# Altium project QCopterCAM.PrjPCB
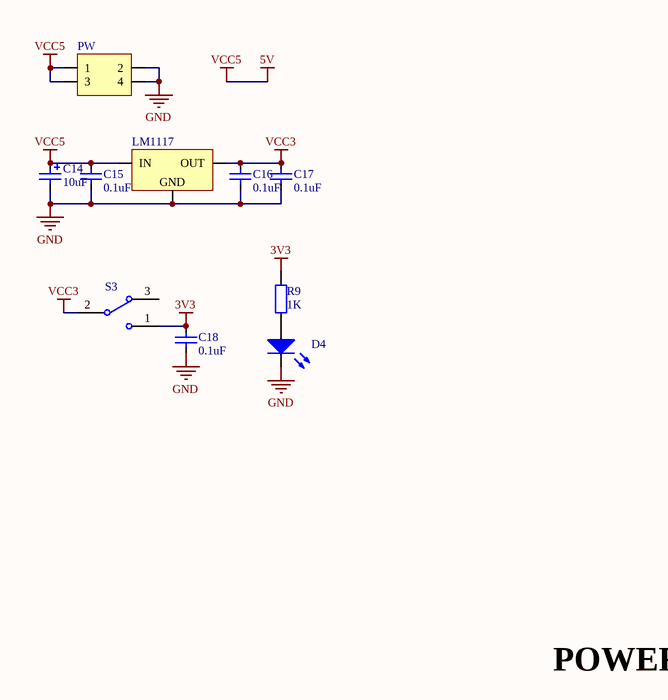
[diagram p0: QCopterCAM_POWER_Sch.SchDoc]
6 sheets, 47 parts. Net scope: flat (ports and power ports of the same name join across sheets).
Board file: QCopterCAM__Pcb.PcbDoc
Sheets:
  QCopterCAM_POWER_Sch.SchDoc
  QCopterCAM_SWD_Sch.SchDoc
  QCopterCAM_MCU_Sch.SchDoc
  QCopterCAM_LED_Sch.SchDoc
  QCopterCAM_PWM_Sch.SchDoc
  QCopterCAM_CAM_Sch.SchDoc

## Sheet QCopterCAM_POWER_Sch.SchDoc
size A4

### Parts
C14  value 10uF  [CAP_TAN_B1210]  (hidden comment: Cap_Tan_1210)
C15  value 0.1uF  [CAP_0603]  (hidden comment: Cap_0603)
C16  value 0.1uF  [CAP_0603]  (hidden comment: Cap_0603)
C17  value 0.1uF  [CAP_0603]  (hidden comment: Cap_0603)
C18  value 0.1uF  [CAP_0603]  (hidden comment: Cap_0603)
D4  LED_0603_BLUE  [LED_0603_BLUE]  (value not drawn)
LM1  LM1117  [SOT223]
PW  HDR2X2_90_2.54  [HDR2X2_90_2.54]  (value not drawn)
R9  value 1K  [RES_0603]  (hidden comment: Res_0603)
S3  SW-SPDT  [SW_T]  (value not drawn)

### Nets
3V3: C18.2 R9.2 S3.1
5V: C14.1 C15.2 LM1.3(IN) PW.1 PW.3  [also labelled VCC5]
GND: C14.2 C15.1 C16.1 C17.1 C18.1 D4.2(K) LM1.1(GND) PW.2 PW.4
VCC3: C16.2 C17.2 LM1.2(OUT) S3.2
NetD4_1: D4.1(A) R9.1

Not connected (* = marked no-connect by the designer): S3 3

### Notes on the sheet
- POWER

### Library data of the parts
C14 = Cap_Tan_1210: Capacitor
C15-C18 = Cap_0603: Capacitor
D4 = LED_0603_BLUE: LED
LM1 = LM1117: Power
PW = HDR2X2_90_2.54: Header
R9 = Res_0603: Resistor
S3 = SW-SPDT_1: SPDT Subminiature Toggle Switch, Right Angle Mounting, Vertical Actuation; Published: 24-Mar-1999; LatestRevisionDate: 17-Dec-2003; LatestRevisionNote: Schematic revised, PCB Footprint replaced.; DatasheetVersion: 05-Dec-2000; PackageReference: TL36WW15050; Publisher: Altium Limited; PackageDescription: Switch; 4 Leads; ComponentLink1Description: Manufacturer Link; ComponentLink1URL: http://www.apem.com

## Sheet QCopterCAM_SWD_Sch.SchDoc
size A4
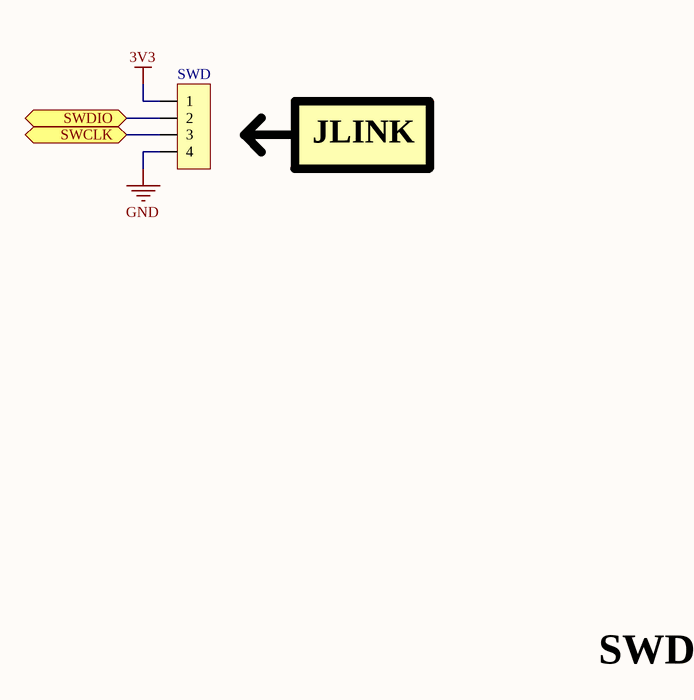
[diagram p1: QCopterCAM_SWD_Sch.SchDoc]

### Parts
SWD  HDR1X4_90F_2.54  [HDR1X4_90F_2.54]  (value not drawn)

### Ports
SWCLK, SWDIO

### Nets
3V3: SWD.1
GND: SWD.4
NetSWD_2: SWD.2 ; port SWDIO
NetSWD_3: SWD.3 ; port SWCLK

### Notes on the sheet
- JLINK
- SWD

### Library data of the parts
SWD = HDR1X4_90F_2.54: Header

## Sheet QCopterCAM_MCU_Sch.SchDoc
size A4
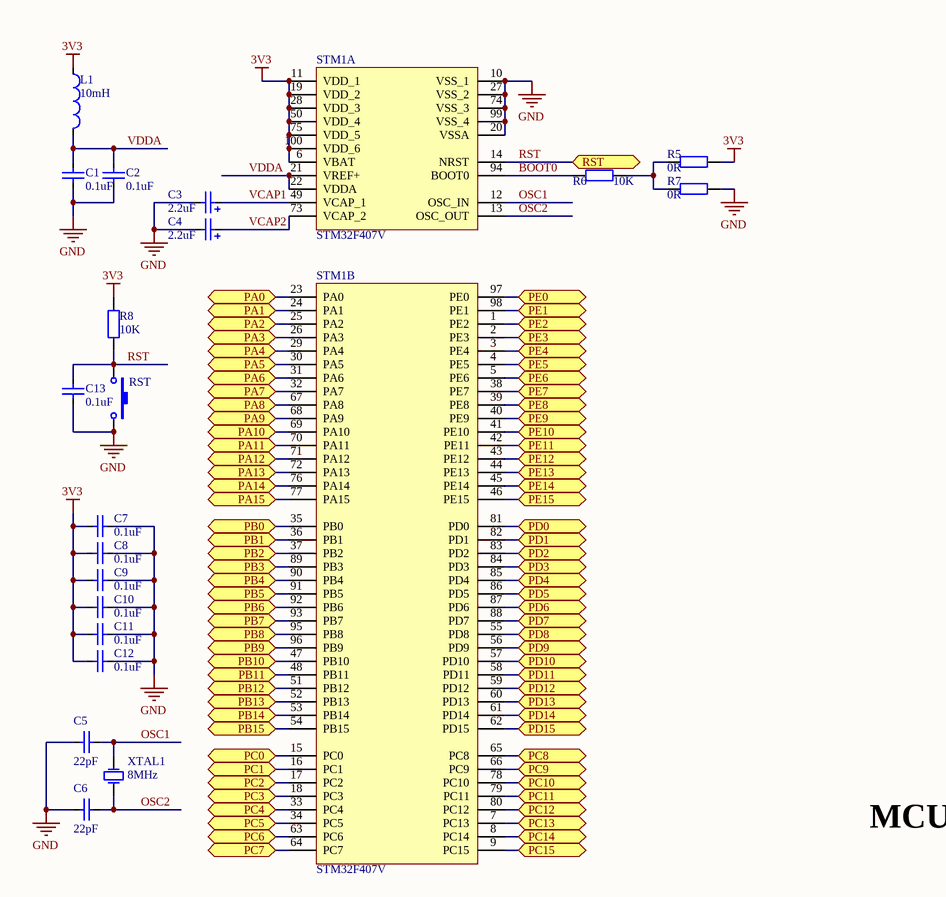
[diagram p2: QCopterCAM_MCU_Sch.SchDoc]

### Parts
C1  value 0.1uF  [CAP_0603]  (hidden comment: Cap_0603)
C2  value 0.1uF  [CAP_0603]  (hidden comment: Cap_0603)
C3  value 2.2uF  [CAP_TAN_P0805]  (hidden comment: Cap_Tan_0805)
C4  value 2.2uF  [CAP_TAN_P0805]  (hidden comment: Cap_Tan_0805)
C5  value 22pF  [CAP_0603]  (hidden comment: Cap_0603)
C6  value 22pF  [CAP_0603]  (hidden comment: Cap_0603)
C7  value 0.1uF  [CAP_0603]  (hidden comment: Cap_0603)
C8  value 0.1uF  [CAP_0603]  (hidden comment: Cap_0603)
C9  value 0.1uF  [CAP_0603]  (hidden comment: Cap_0603)
C10  value 0.1uF  [CAP_0603]  (hidden comment: Cap_0603)
C11  value 0.1uF  [CAP_0603]  (hidden comment: Cap_0603)
C12  value 0.1uF  [CAP_0603]  (hidden comment: Cap_0603)
C13  value 0.1uF  [CAP_0603]  (hidden comment: Cap_0603)
L1  value 10mH  [IND_0603]  (hidden comment: Ind_0603)
R5  value 0R  [RES_0603]  (hidden comment: Res_0603)
R6  value 10K  [RES_0603]  (hidden comment: Res_0603)
R7  value 0R  [RES_0603]  (hidden comment: Res_0603)
R8  value 10K  [RES_0603]  (hidden comment: Res_0603)
RST  SW-PB_1  [BT_90_T]  (value not drawn)
STM1  STM32F407V  [STM32F_100]  (parts A,B of 2)
XTAL1  value 8MHz  [XTAL_5032]  (hidden comment: XTAL_5032)

### Ports
PA0, PA1, PA2, PA3, PA4, PA5, PA6, PA7, PA8, PA9, PA10, PA11, PA12, PA13, PA14, PA15, PB0, PB1, PB2, PB3, PB4, PB5, PB6, PB7, PB8, PB9, PB10, PB11, PB12, PB13, PB14, PB15, PC0, PC1, PC2, PC3, PC4, PC5, PC6, PC7, PC8, PC9, PC10, PC11, PC12, PC13, PC14, PC15, PD0, PD1, PD2, PD3, PD4, PD5, PD6, PD7, PD8, PD9, PD10, PD11, PD12, PD13, PD14, PD15, PE0, PE1, PE2, PE3, PE4, PE5, PE6, PE7, PE8, PE9, PE10, PE11, PE12, PE13, PE14, PE15, RST

### Nets
3V3: C7.2 C8.2 C9.2 C10.2 C11.2 C12.2 L1.1 R5.2 R8.1 STM1.6(VBAT) STM1.11(VDD_1) STM1.19(VDD_2) STM1.28(VDD_3) STM1.50(VDD_4) STM1.75(VDD_5) STM1.100(VDD_6)
GND: C1.2 C2.2 C3.2 C4.2 C5.1 C6.1 C7.1 C8.1 C9.1 C10.1 C11.1 C12.1 C13.2 R7.2 RST.2 STM1.10(VSS_1) STM1.20(VSSA) STM1.27(VSS_2) STM1.74(VSS_3) STM1.99(VSS_4)
BOOT0: R6.1 STM1.94(BOOT0)
OSC1: C5.2 STM1.12(OSC_IN) XTAL1.2(OSC2)
OSC2: C6.2 STM1.13(OSC_OUT) XTAL1.1(OSC1)
RST: C13.1 R8.2 RST.1 STM1.14(NRST) ; port RST
VCAP1: C3.1 STM1.49(VCAP_1)
VCAP2: C4.1 STM1.73(VCAP_2)
VDDA: C1.1 C2.1 L1.2 STM1.21(VREF+) STM1.22(VDDA)
NetR5_1: R5.1 R6.2 R7.1
NetSTM1_1: STM1.1(PE2) ; port PE2
NetSTM1_2: STM1.2(PE3) ; port PE3
NetSTM1_3: STM1.3(PE4) ; port PE4
NetSTM1_4: STM1.4(PE5) ; port PE5
NetSTM1_5: STM1.5(PE6) ; port PE6
NetSTM1_7: STM1.7(PC13) ; port PC13
NetSTM1_8: STM1.8(PC14) ; port PC14
NetSTM1_9: STM1.9(PC15) ; port PC15
NetSTM1_15: STM1.15(PC0) ; port PC0
NetSTM1_16: STM1.16(PC1) ; port PC1
NetSTM1_17: STM1.17(PC2) ; port PC2
NetSTM1_18: STM1.18(PC3) ; port PC3
NetSTM1_23: STM1.23(PA0) ; port PA0
NetSTM1_24: STM1.24(PA1) ; port PA1
NetSTM1_25: STM1.25(PA2) ; port PA2
NetSTM1_26: STM1.26(PA3) ; port PA3
NetSTM1_29: STM1.29(PA4) ; port PA4
NetSTM1_30: STM1.30(PA5) ; port PA5
NetSTM1_31: STM1.31(PA6) ; port PA6
NetSTM1_32: STM1.32(PA7) ; port PA7
NetSTM1_33: STM1.33(PC4) ; port PC4
NetSTM1_34: STM1.34(PC5) ; port PC5
NetSTM1_35: STM1.35(PB0) ; port PB0
NetSTM1_36: STM1.36(PB1) ; port PB1
NetSTM1_37: STM1.37(PB2) ; port PB2
NetSTM1_38: STM1.38(PE7) ; port PE7
NetSTM1_39: STM1.39(PE8) ; port PE8
NetSTM1_40: STM1.40(PE9) ; port PE9
NetSTM1_41: STM1.41(PE10) ; port PE10
NetSTM1_42: STM1.42(PE11) ; port PE11
NetSTM1_43: STM1.43(PE12) ; port PE12
NetSTM1_44: STM1.44(PE13) ; port PE13
NetSTM1_45: STM1.45(PE14) ; port PE14
NetSTM1_46: STM1.46(PE15) ; port PE15
NetSTM1_47: STM1.47(PB10) ; port PB10
NetSTM1_48: STM1.48(PB11) ; port PB11
NetSTM1_51: STM1.51(PB12) ; port PB12
NetSTM1_52: STM1.52(PB13) ; port PB13
NetSTM1_53: STM1.53(PB14) ; port PB14
NetSTM1_54: STM1.54(PB15) ; port PB15
NetSTM1_55: STM1.55(PD8) ; port PD8
NetSTM1_56: STM1.56(PD9) ; port PD9
NetSTM1_57: STM1.57(PD10) ; port PD10
NetSTM1_58: STM1.58(PD11) ; port PD11
NetSTM1_59: STM1.59(PD12) ; port PD12
NetSTM1_60: STM1.60(PD13) ; port PD13
NetSTM1_61: STM1.61(PD14) ; port PD14
NetSTM1_62: STM1.62(PD15) ; port PD15
NetSTM1_63: STM1.63(PC6) ; port PC6
NetSTM1_64: STM1.64(PC7) ; port PC7
NetSTM1_65: STM1.65(PC8) ; port PC8
NetSTM1_66: STM1.66(PC9) ; port PC9
NetSTM1_67: STM1.67(PA8) ; port PA8
NetSTM1_68: STM1.68(PA9) ; port PA9
NetSTM1_69: STM1.69(PA10) ; port PA10
NetSTM1_70: STM1.70(PA11) ; port PA11
NetSTM1_71: STM1.71(PA12) ; port PA12
NetSTM1_72: STM1.72(PA13) ; port PA13
NetSTM1_76: STM1.76(PA14) ; port PA14
NetSTM1_77: STM1.77(PA15) ; port PA15
NetSTM1_78: STM1.78(PC10) ; port PC10
NetSTM1_79: STM1.79(PC11) ; port PC11
NetSTM1_80: STM1.80(PC12) ; port PC12
NetSTM1_81: STM1.81(PD0) ; port PD0
NetSTM1_82: STM1.82(PD1) ; port PD1
NetSTM1_83: STM1.83(PD2) ; port PD2
NetSTM1_84: STM1.84(PD3) ; port PD3
NetSTM1_85: STM1.85(PD4) ; port PD4
NetSTM1_86: STM1.86(PD5) ; port PD5
NetSTM1_87: STM1.87(PD6) ; port PD6
NetSTM1_88: STM1.88(PD7) ; port PD7
NetSTM1_89: STM1.89(PB3) ; port PB3
NetSTM1_90: STM1.90(PB4) ; port PB4
NetSTM1_91: STM1.91(PB5) ; port PB5
NetSTM1_92: STM1.92(PB6) ; port PB6
NetSTM1_93: STM1.93(PB7) ; port PB7
NetSTM1_95: STM1.95(PB8) ; port PB8
NetSTM1_96: STM1.96(PB9) ; port PB9
NetSTM1_97: STM1.97(PE0) ; port PE0
NetSTM1_98: STM1.98(PE1) ; port PE1

### Notes on the sheet
- MCU

### Library data of the parts
C1 C2 C5-C13 = Cap_0603: Capacitor
C3 C4 = Cap_Tan_0805: Capacitor
L1 = Ind_0603: Inductor
R5-R8 = Res_0603: Resistor
RST = SW-PB_1: Switch; Published: 24-Mar-1999; LatestRevisionDate: 17-Jul-2002; LatestRevisionNote: Re-released for DXP Platform.; PackageReference: SPST-2; Publisher: Altium Limited; PackageDescription: Switch; 2 Leads
STM1 = STM32F407V: MCU
XTAL1 = XTAL_5032: Crystal Oscillator; Published: 8-Jun-2000; LatestRevisionDate: 17-Jul-2002; LatestRevisionNote: Re-released for DXP Platform.; PackageReference: R38; Publisher: Altium Limited; PackageDescription: Crystal, Thru-Hole; 2 Leads; Body 3.1 x 8.2 mm (Dia.xH)

## Sheet QCopterCAM_LED_Sch.SchDoc
size A4
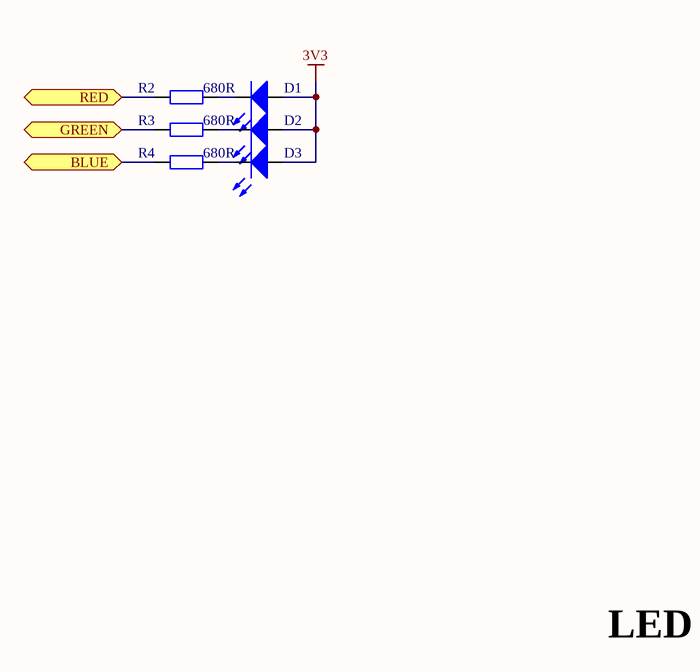
[diagram p3: QCopterCAM_LED_Sch.SchDoc]

### Parts
D1  LED_0603_RED  [LED_0603_RED]  (value not drawn)
D2  LED_0603_GREEN  [LED_0603_GREEN]  (value not drawn)
D3  LED_0603_BLUE  [LED_0603_BLUE]  (value not drawn)
R2  value 680R  [RES_0603]  (hidden comment: Res_0603)
R3  value 680R  [RES_0603]  (hidden comment: Res_0603)
R4  value 680R  [RES_0603]  (hidden comment: Res_0603)

### Ports
BLUE, GREEN, RED

### Nets
3V3: D1.1(A) D2.1(A) D3.1(A)
NetD1_2: D1.2(K) R2.2
NetD2_2: D2.2(K) R3.2
NetD3_2: D3.2(K) R4.2
NetR2_1: R2.1 ; port RED
NetR3_1: R3.1 ; port GREEN
NetR4_1: R4.1 ; port BLUE

### Notes on the sheet
- LED

### Library data of the parts
D1 = LED_0603_RED: LED
D2 = LED_0603_GREEN: LED
D3 = LED_0603_BLUE: LED
R2-R4 = Res_0603: Resistor

## Sheet QCopterCAM_PWM_Sch.SchDoc
size A4
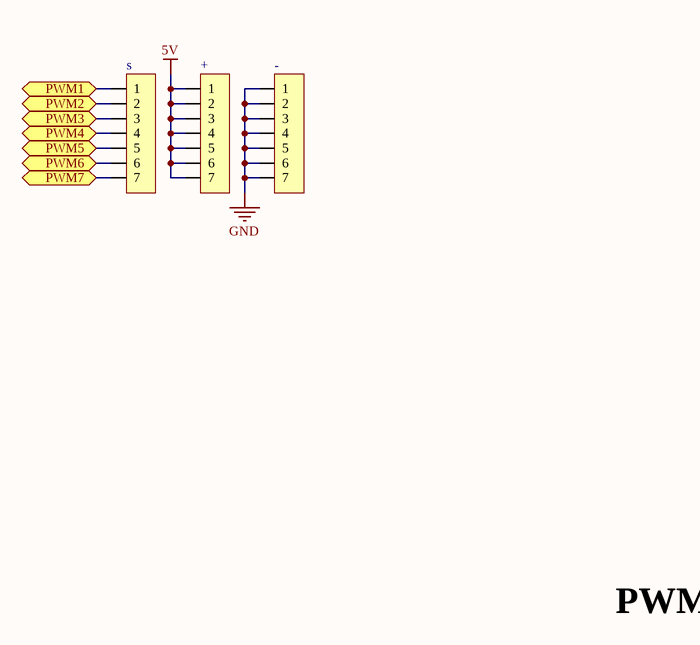
[diagram p4: QCopterCAM_PWM_Sch.SchDoc]

### Parts
+  HDR1X7_180_2.54  [HDR1X7_180_2.54]  (value not drawn)
-  HDR1X7_180_2.54  [HDR1X7_180_2.54]  (value not drawn)
s  HDR1X7_180_2.54  [HDR1X7_180_2.54]  (value not drawn)

### Ports
PWM1, PWM2, PWM3, PWM4, PWM5, PWM6, PWM7

### Nets
5V: +.1 +.2 +.3 +.4 +.5 +.6 +.7
GND: -.1 -.2 -.3 -.4 -.5 -.6 -.7
Nets_1: s.1 ; port PWM1
Nets_2: s.2 ; port PWM2
Nets_3: s.3 ; port PWM3
Nets_4: s.4 ; port PWM4
Nets_5: s.5 ; port PWM5
Nets_6: s.6 ; port PWM6
Nets_7: s.7 ; port PWM7

### Notes on the sheet
- PWM

### Library data of the parts
+ - s = HDR1X7_180_2.54: Header

## Sheet QCopterCAM_CAM_Sch.SchDoc
size A4
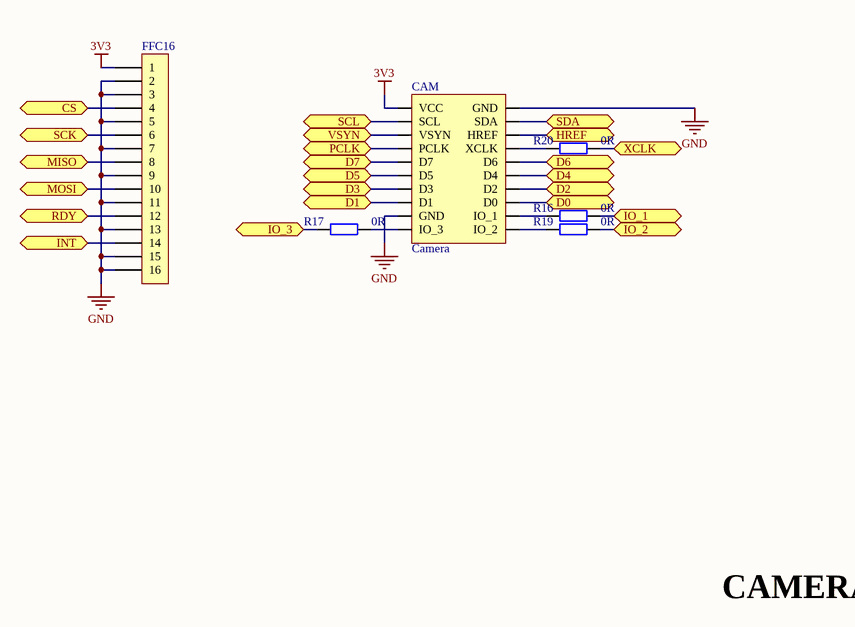
[diagram p5: QCopterCAM_CAM_Sch.SchDoc]

### Parts
CAM  Camera  [CAMERA]
FFC16  FFC_0.5_16  [FFC_0.5_16]  (value not drawn)
R16  value 0R  [RES_0603]  (hidden comment: Res_0603)
R17  value 0R  [RES_0603]  (hidden comment: Res_0603)
R19  value 0R  [RES_0603]  (hidden comment: Res_0603)
R20  value 0R  [RES_0603]  (hidden comment: Res_0603)

### Ports
CS, D0, D1, D2, D3, D4, D5, D6, D7, HREF, INT, IO_1, IO_2, IO_3, MISO, MOSI, PCLK, RDY, SCK, SCL, SDA, VSYN, XCLK

### Nets
3V3: CAM.1(VCC) FFC16.1
GND: CAM.2(GND) CAM.17(GND) FFC16.2 FFC16.3 FFC16.5 FFC16.7 FFC16.9 FFC16.11 FFC16.13 FFC16.15 FFC16.16
NetCAM_3: CAM.3(SCL) ; port SCL
NetCAM_4: CAM.4(SDA) ; port SDA
NetCAM_5: CAM.5(VSYN) ; port VSYN
NetCAM_6: CAM.6(HREF) ; port HREF
NetCAM_7: CAM.7(PCLK) ; port PCLK
NetCAM_8: CAM.8(XCLK) R20.1
NetCAM_9: CAM.9(D7) ; port D7
NetCAM_10: CAM.10(D6) ; port D6
NetCAM_11: CAM.11(D5) ; port D5
NetCAM_12: CAM.12(D4) ; port D4
NetCAM_13: CAM.13(D3) ; port D3
NetCAM_14: CAM.14(D2) ; port D2
NetCAM_15: CAM.15(D1) ; port D1
NetCAM_16: CAM.16(D0) ; port D0
NetCAM_18: CAM.18(IO_1) R16.1
NetCAM_19: CAM.19(IO_3) R17.2
NetCAM_20: CAM.20(IO_2) R19.1
NetFFC16_4: FFC16.4 ; port CS
NetFFC16_6: FFC16.6 ; port SCK
NetFFC16_8: FFC16.8 ; port MISO
NetFFC16_10: FFC16.10 ; port MOSI
NetFFC16_12: FFC16.12 ; port RDY
NetFFC16_14: FFC16.14 ; port INT
NetR16_2: R16.2 ; port IO_1
NetR17_1: R17.1 ; port IO_3
NetR19_2: R19.2 ; port IO_2
NetR20_2: R20.2 ; port XCLK

### Notes on the sheet
- CAMERA

### Library data of the parts
CAM = Camera: Module
FFC16 = FFC_0.5_16: FFC
R16 R17 R19 R20 = Res_0603: Resistor

## Nets that join several sheets
3V3: QCopterCAM_POWER_Sch (C18.2 R9.2 S3.1), QCopterCAM_SWD_Sch (SWD.1), QCopterCAM_MCU_Sch (16 pins), QCopterCAM_LED_Sch (D1.1 D2.1 D3.1), QCopterCAM_CAM_Sch (CAM.1 FFC16.1)
5V: QCopterCAM_POWER_Sch (5 pins), QCopterCAM_PWM_Sch (7 pins)
GND: QCopterCAM_POWER_Sch (9 pins), QCopterCAM_SWD_Sch (SWD.4), QCopterCAM_MCU_Sch (20 pins), QCopterCAM_PWM_Sch (7 pins), QCopterCAM_CAM_Sch (11 pins)